# Altium schematic sheet Audio_Output_Headphone.SchDoc: Heaphone Out
size 279 x 215 mm; DrawnBy: Connor Dack; Engineer: Connor Dack; DocumentNumber: 11; Revision: 1.0; SheetNumber: 11; SheetTotal: 11
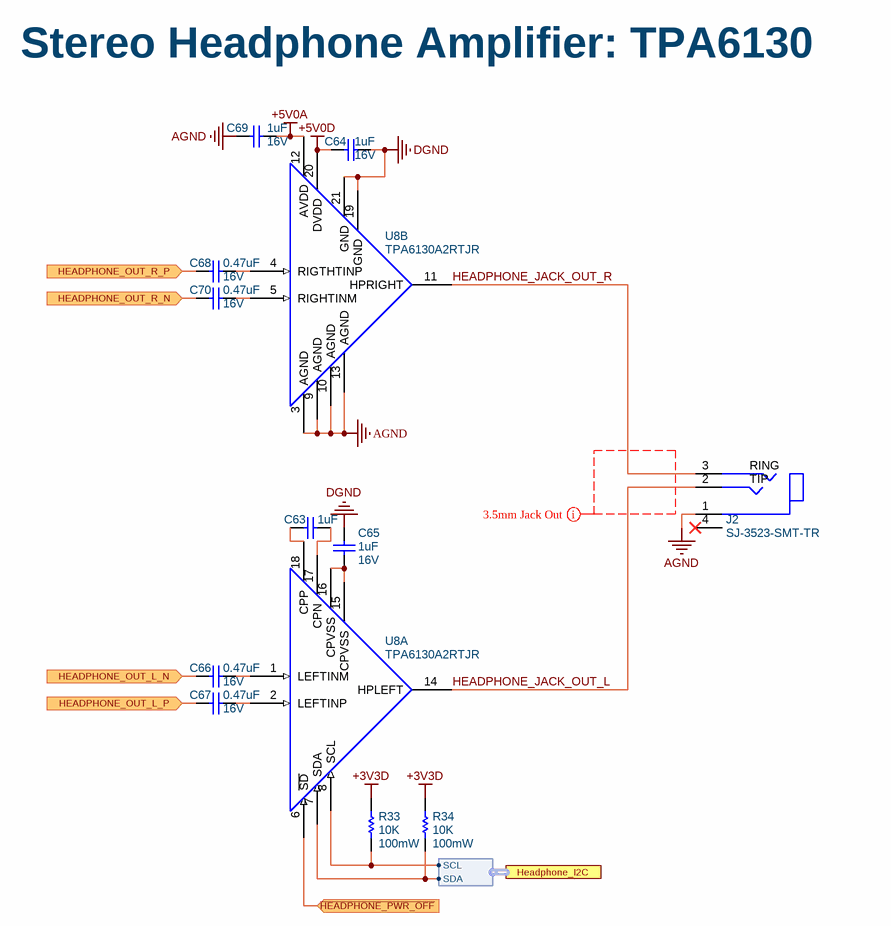
[diagram p0: Audio_Output_Headphone.SchDoc]

## Parts
C63  Capacitance: 1uF  [3-0603_L]  (hidden comment: CGA3E1X7R1C105M080AC)
C64  Voltage Rating: 16V  Capacitance: 1uF  [3-0603_L]  (hidden comment: CGA3E1X7R1C105M080AC)
C65  Voltage Rating: 16V  Capacitance: 1uF  [3-0603_L]  (hidden comment: CGA3E1X7R1C105M080AC)
C66  Voltage Rating: 16V  Capacitance: 0.47uF  [3-0603_L]  (hidden comment: CGA3E1X7R1C474M080AC)
C67  Voltage Rating: 16V  Capacitance: 0.47uF  [3-0603_L]  (hidden comment: CGA3E1X7R1C474M080AC)
C68  Voltage Rating: 16V  Capacitance: 0.47uF  [3-0603_L]  (hidden comment: CGA3E1X7R1C474M080AC)
C69  Voltage Rating: 16V  Capacitance: 1uF  [3-0603_L]  (hidden comment: CGA3E1X7R1C105M080AC)
C70  Voltage Rating: 16V  Capacitance: 0.47uF  [3-0603_L]  (hidden comment: CGA3E1X7R1C474M080AC)
J2  SJ-3523-SMT-TR  [SJ-3523-SMT-TR]
R33  Power (Watts): 100mW  Resistance (Ohms): 10K  [3-0603_R_L_DNP]  (hidden comment: ERJ-3GEYJ103V)
R34  Power (Watts): 100mW  Resistance (Ohms): 10K  [3-0603_R_L_DNP]  (hidden comment: ERJ-3GEYJ103V)
U8  TPA6130A2RTJR  [QFN50P400X400X80_HS-21N]  (parts A,B of 2)

## Ports
Headphone_I2C (harness I2C_Headphone), HEADPHONE_OUT_L_N (in), HEADPHONE_OUT_L_P (in), HEADPHONE_OUT_R_N (in), HEADPHONE_OUT_R_P (in), ~{HEADPHONE_PWR_OFF} (in)

## Harnesses
I2C_Headphone: SDA, SCL

## Nets
+3V3D: R33.2 R34.2
+5V0A: C69.2 U8.12(AVDD)
+5V0D: C64.1 U8.20(DVDD)
AGND: C69.1 J2.1(Sleeve) U8.3(AGND) U8.9(AGND) U8.10(AGND) U8.13(AGND)
DGND: C64.2 C65.2 U8.19(GND) U8.21(GND)
~{HEADPHONE_PWR_OFF}: U8.6(~{SD}) ; port ~{HEADPHONE_PWR_OFF}
HEADPHONE_JACK_OUT_L: J2.2(Tip) U8.14(HPLEFT)
HEADPHONE_JACK_OUT_R: J2.3(Ring) U8.11(HPRIGHT)
HEADPHONE_OUT_L_N: C66.1 ; port HEADPHONE_OUT_L_N
HEADPHONE_OUT_L_P: C67.1 ; port HEADPHONE_OUT_L_P
HEADPHONE_OUT_R_N: C70.1 ; port HEADPHONE_OUT_R_N
HEADPHONE_OUT_R_P: C68.1 ; port HEADPHONE_OUT_R_P
NetC63_1: C63.1 U8.18(CPP)
NetC63_2: C63.2 U8.17(CPN)
NetC65_1: C65.1 U8.15(CPVSS) U8.16(CPVSS)
NetC66_2: C66.2 U8.1(LEFTINM)
NetC67_2: C67.2 U8.2(LEFTINP)
NetC68_2: C68.2 U8.4(RIGTHTINP)
NetC70_2: C70.2 U8.5(RIGHTINM)
NetR33_1: R33.1 U8.8(SCL) ; port Headphone_I2C.SCL
NetR34_1: R34.1 U8.7(SDA) ; port Headphone_I2C.SDA

Not connected (* = marked no-connect by the designer): J2 4(NC)*

## Layout directives
net class 3.5mm Jack Out: (no net found under the mark)

## Notes on the sheet
- Stereo Headphone Amplifier: TPA6130
- Title:
- Rev:
- Sheet:
- Date:
- of
- Time:
- Size:
- 11 x 8.5 Inches
- Engineer:
- File:
- This document contains confidential and proprietary information belonging to flat earth of Bozeman, Montana.
  This information can not be disclosed to anyone outside of flat earth without written permission from flat earth.
- (in symbol SJ-3523-SMT-TR) RING; TIP

## Library data of the parts
C63-C65 C69 = CGA3E1X7R1C105M080AC: CAP CER 1UF 16V X7R 0603; Manufacturer: TDK; Tolerance: 20%; Supplier 1: Digi-Key; Manufacturer Part Number: CGA3E1X7R1C105M080AC; Stock 1: 18034; Pricing 1: 1=0.14, 10=0.1, 100=0.0468, 500=0.0328, 1000=0.0272 (USD); Mount: Surface Mount; Case/Package: 0603; Weight: 7.1E-05oz; Case Code (Metric): 1608; Case Code (Imperial): 0603; Min Operating Temperature: -55°C; Max Operating Temperature: 125°C; Package Quantity: 4000; Packaging: Tape and Reel; Dielectric: X7R; Termination: SMD/SMT; Voltage Rating (DC): 16V; Length: 0.063inch; Height: 0.8mm; Width: 0.031inch; Thickness: 0.035inch; Lead Free: Lead Free; ComponentLink1URL: https://product.tdk.com/info/en/catalog/datasheets/mlcc_automotive_general_en.pdf; ComponentLink1Description: https://product.tdk.com/info/en/catalog/datasheets/mlcc_automotive_general_en.pdf; ComponentLink2URL: http://product.tdk.com/capacitor/mlcc/detailed_information.php?lang=en&ref=jp&part_no=CGA3E1X7R1C105M080AC; ComponentLink2Description: http://product.tdk.com/capacitor/mlcc/detailed_information.php?lang=en&ref=jp&part_no=CGA3E1X7R1C105M080AC; ComponentLink3URL: http://product.tdk.com/en/catalog/datasheets/mlcc_automotive_general_en.pdf; ComponentLink3Description: http://product.tdk.com/en/catalog/datasheets/mlcc_automotive_general_en.pdf; Supplier Part Number 1: 445-12540-6-ND
  C63: Voltage Rating: 16V
C66-C68 C70 = CGA3E1X7R1C474M080AC: CAP CER 0.47UF 16V X7R 0603; Manufacturer: TDK; Tolerance: 20%; Supplier 1: Digi-Key; Manufacturer Part Number: CGA3E1X7R1C474M080AC; Stock 1: 6138; Pricing 1: 1=0.18, 10=0.129, 100=0.0605, 500=0.0424, 1000=0.0351 (USD); Mount: Surface Mount; Case/Package: 0603; Weight: 7.1E-05oz; Case Code (Metric): 1608; Case Code (Imperial): 0603; Min Operating Temperature: -55°C; Max Operating Temperature: 125°C; Package Quantity: 4000; Packaging: Tape and Reel; Dielectric: X7R; Voltage Rating (DC): 16V; Length: 0.063inch; Height: 0.8mm; Width: 0.031inch; Thickness: 0.035inch; ComponentLink1URL: https://product.tdk.com/info/en/catalog/datasheets/mlcc_automotive_general_en.pdf; ComponentLink1Description: https://product.tdk.com/info/en/catalog/datasheets/mlcc_automotive_general_en.pdf; ComponentLink2URL: http://product.tdk.com/capacitor/mlcc/detailed_information.php?lang=en&ref=jp&part_no=CGA3E1X7R1C474M080AC; ComponentLink2Description: http://product.tdk.com/capacitor/mlcc/detailed_information.php?lang=en&ref=jp&part_no=CGA3E1X7R1C474M080AC; ComponentLink3URL: http://product.tdk.com/en/catalog/datasheets/mlcc_automotive_general_en.pdf; ComponentLink3Description: http://product.tdk.com/en/catalog/datasheets/mlcc_automotive_general_en.pdf; Supplier Part Number 1: 445-12537-6-ND
J2 = SJ-3523-SMT-TR: 3.50mm (0.141", 1/8", Mini Plug) - Headphone Phone Jack Stereo Connector Solder; Manufacturer: CUI Inc.; Gender: Female; Actual Diameter: 0.142" (3.60mm); Number of Positions/Contacts: 3 Conductors, 3 Contacts; Internal Switch(s): Does Not Contain Switch; Shielding: Unshielded; Voltage - Rated: 12VDC; Current Rating: 1A; Mating Length/Depth: 0.551" (14.00mm); Body Color: Black; Includes: 1 pc - 1 Connector; LatestRevisionDate: 17-Jul-2002; LatestRevisionNote: Re-released for DXP Platform.; Publisher: Altium Limited; Supplier 1: Digi-Key; RoHS: RoHS Compliant; Category: Connectors, Interconnects; Stock 1: 104981; Pricing 1: 1=1.34, 10=1.043, 100=0.7961, 500=0.63558 (USD); Packaging: Cut Tape (CT); Part Status: Active; Connector Type: Phone Jack; Signal Lines: Stereo; Industry Recognized Mating Diameter: 3.50mm (0.141", 1/8", Mini Plug) - Headphone; Mounting Type: Surface Mount, Right Angle; Termination: Solder; Features: Board Guide; Insulation Color: -; Contact Material - Plating: Silver; Body Material: -; ComponentLink1URL: http://www.cui.com/product/resource/digikeypdf/sj-352x-smt_series.pdf; ComponentLink1Description: http://www.cui.com/product/resource/digikeypdf/sj-352x-smt_series.pdf; Supplier Part Number 1: CP-3523SJCT-ND; Manufacturer Part Number: SJ-3523-SMT-TR
R33 R34 = ERJ-3GEYJ103V: RES 10K OHM 1/10W 5% 0603 SMD; Manufacturer: Panasonic - ECG; Temperature Coefficient: ±200ppm/°C; Supplier 1: Digi-Key; Manufacturer Part Number: ERJ-3GEYJ103V; RoHS: RoHS Compliant; Category: Resistors; Stock 1: 16219504; Pricing 1: 1=0.02, 50=0.0092, 100=0.007, 250=0.0052, 500=0.00384, 1000=0.00256 (USD); Composition: Thick Film; Features: -; Tolerance: ±5%; Package / Case: 0603 (1608 Metric); Size / Dimension: 0.063" L x 0.031" W (1.60mm x 0.80mm); Height: 0.022" (0.55mm); Number of Terminations: 2; Packaging: Cut Tape (CT); ComponentLink1URL: http://industrial.panasonic.com/www-cgi/jvcr13pz.cgi?E+PZ+3+AOA0001+ERJ3GEYJ103V+7+WW; ComponentLink1Description: http://industrial.panasonic.com/www-cgi/jvcr13pz.cgi?E+PZ+3+AOA0001+ERJ3GEYJ103V+7+WW; Supplier Part Number 1: P10KGCT-ND; Load Status: *
U8 = TPA6130A2RTJR: Amplifier IC Headphones, 2-Channel (Stereo) Class AB 20-QFN (4x4); Manufacturer: Texas Instruments; Max Output Power x Channels @ Load: 290mW x 1 @ 16 Ohm; 138mW x 2 @ 16 Ohm; Voltage - Supply: 2.5 V ~ 5.5 V; LatestRevisionDate: 17-Jul-2002; LatestRevisionNote: Re-released for DXP Platform.; Publisher: Altium Limited; Supplier 1: Digi-Key; RoHS: RoHS Compliant; Category: Integrated Circuits (ICs); Stock 1: 15763; Pricing 1: 1=2.19, 10=1.966, 100=1.5768, 500=1.296, 1000=0.9 (USD); Packaging: Cut Tape (CT); Part Status: Active; Type: Class AB; Output Type: Headphones, 2-Channel (Stereo); Features: Depop, Differential Inputs, I²C, Mute, Short-Circuit and Thermal Protection, Shutdown, Volume Control; Mounting Type: Surface Mount; Operating Temperature: -40°C ~ 85°C (TA); Supplier Device Package: 20-QFN (4x4); Package / Case: 20-WFQFN Exposed Pad; ComponentLink1URL: http://www.ti.com/lit/ds/symlink/tpa6130a2.pdf; ComponentLink1Description: http://www.ti.com/lit/ds/symlink/tpa6130a2.pdf; Supplier Part Number 1: 296-21656-1-ND; Manufacturer Part Number: TPA6130A2RTJR